# Altium schematic sheet Kasli-SOC_bank112.SchDoc: MGT
size 420 x 297 mm; CheckedBy: G.Kasprowicz; Author: F.Switakowski; CompanyName: WUT ISE; DrawnBy: F.Switakowski; Organization: WUT ISE; Address1: PW ISE; Address2: Nowowiejska 15/19 00-665 Warsaw; Address3: gkasprow@gmail.com; DocumentNumber: 5; Revision: 1; SheetNumber: 5; SheetTotal: 18; ModifiedBy: -; CheckedDate: -; Title2: & clock; DivGrp: WUT ISE; Designer: G.Kasprowicz; ModifiedDate: -; ProjectName: Sensor Box
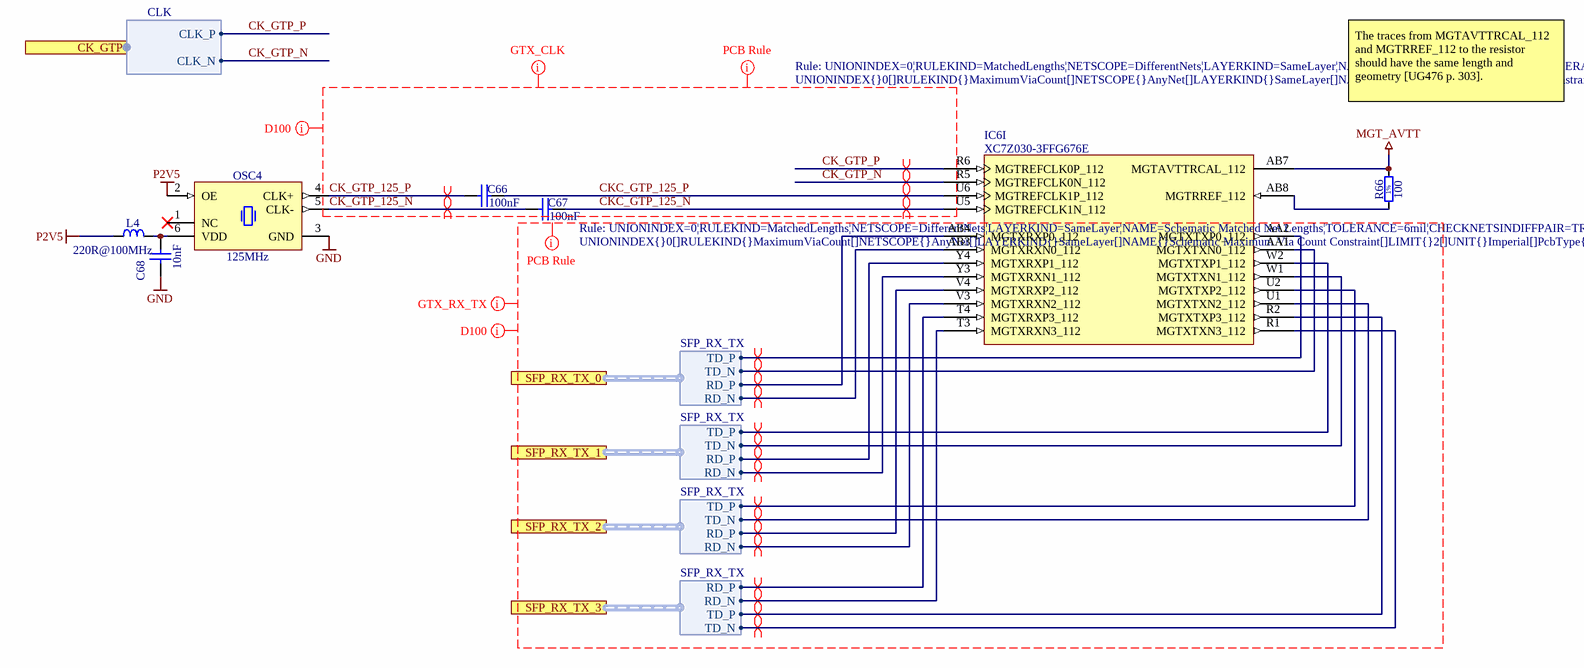
[diagram p0: Kasli-SOC_bank112.SchDoc]

## Parts
C66  100nF  [CAPC0603X33N]
C67  100nF  [CAPC0603X33N]
C68  10nF  [CAPC1005X55N]
IC6  XC7Z030-3FFG676E  [BGA676C100P26X26_2700X2700X324]  (part I of 14)
L4  220R@100MHz  [INDC2012X105N]
OSC4  125MHz  [OSC_SILICON-LAB_SI510-6N(5X7)]
R66  100  [RESC0603X28N]

## Ports
CK_GTP (harness CLK), SFP_RX_TX_0 (harness SFP_RX_TX), SFP_RX_TX_1 (harness SFP_RX_TX), SFP_RX_TX_2 (harness SFP_RX_TX), SFP_RX_TX_3 (harness SFP_RX_TX)

## Harnesses
SFP_RX_TX: RD_N, RD_P, TD_N, TD_P
CLK: CLK_P, CLK_N

## Nets
GND: C68.1 OSC4.3(GND)
MGT_AVTT: IC6.AB7(MGTAVTTRCAL_112) R66.2
P2V5: L4.1 OSC4.2(OE)
CK_GTP_125_N: C67.1 OSC4.5(CLK-)
CK_GTP_125_P: C66.1 OSC4.4(CLK+)
CK_GTP_N: IC6.R5(MGTREFCLK0N_112) ; port CK_GTP.CLK_N
CK_GTP_P: IC6.R6(MGTREFCLK0P_112) ; port CK_GTP.CLK_P
CKC_GTP_125_N: C67.2 IC6.U5(MGTREFCLK1N_112)
CKC_GTP_125_P: C66.2 IC6.U6(MGTREFCLK1P_112)
NetC68_2: C68.2 L4.2 OSC4.6(VDD)
NetIC6_AA1: IC6.AA1(MGTXTXN0_112) ; port SFP_RX_TX_0.TD_N
NetIC6_AA2: IC6.AA2(MGTXTXP0_112) ; port SFP_RX_TX_0.TD_P
NetIC6_AB3: IC6.AB3(MGTXRXN0_112) ; port SFP_RX_TX_0.RD_N
NetIC6_AB4: IC6.AB4(MGTXRXP0_112) ; port SFP_RX_TX_0.RD_P
NetIC6_AB8: IC6.AB8(MGTRREF_112) R66.1
NetIC6_R1: IC6.R1(MGTXTXN3_112) ; port SFP_RX_TX_3.TD_N
NetIC6_R2: IC6.R2(MGTXTXP3_112) ; port SFP_RX_TX_3.TD_P
NetIC6_T3: IC6.T3(MGTXRXN3_112) ; port SFP_RX_TX_3.RD_N
NetIC6_T4: IC6.T4(MGTXRXP3_112) ; port SFP_RX_TX_3.RD_P
NetIC6_U1: IC6.U1(MGTXTXN2_112) ; port SFP_RX_TX_2.TD_N
NetIC6_U2: IC6.U2(MGTXTXP2_112) ; port SFP_RX_TX_2.TD_P
NetIC6_V3: IC6.V3(MGTXRXN2_112) ; port SFP_RX_TX_2.RD_N
NetIC6_V4: IC6.V4(MGTXRXP2_112) ; port SFP_RX_TX_2.RD_P
NetIC6_W1: IC6.W1(MGTXTXN1_112) ; port SFP_RX_TX_1.TD_N
NetIC6_W2: IC6.W2(MGTXTXP1_112) ; port SFP_RX_TX_1.TD_P
NetIC6_Y3: IC6.Y3(MGTXRXN1_112) ; port SFP_RX_TX_1.RD_N
NetIC6_Y4: IC6.Y4(MGTXRXP1_112) ; port SFP_RX_TX_1.RD_P

Not connected (* = marked no-connect by the designer): OSC4 1(NC)*

## Layout directives
net class GTX_RXTX: (no net found under the mark)
rule Matched Net Lengths [Tolerance = 0.152mm]; rule Maximum Via Count Constraint [Max Count = 2]: (no net found under the mark)
net class GTX_CLK: CK_GTP_125_N, CK_GTP_125_P, CK_GTP_N, CK_GTP_P, CKC_GTP_125_N, CKC_GTP_125_P
rule Matched Net Lengths [Tolerance = 1.575mm]; rule Maximum Via Count Constraint [Max Count = 2]: CK_GTP_125_N, CK_GTP_125_P, CK_GTP_N, CK_GTP_P, CKC_GTP_125_N, CKC_GTP_125_P
differential pair; differential pair class Diff_100Ohm; differential pair class GTP: NetIC6_AA1, NetIC6_AA2, NetIC6_AB3, NetIC6_AB4, NetIC6_R1, NetIC6_R2, NetIC6_T3, NetIC6_T4, NetIC6_U1, NetIC6_U2, NetIC6_V3, NetIC6_V4, NetIC6_W1, NetIC6_W2, NetIC6_Y3, NetIC6_Y4
differential pair; differential pair class LVPECL: CK_GTP_N, CK_GTP_P
differential pair; differential pair class Diff_100Ohm: CK_GTP_125_N, CK_GTP_125_P, CKC_GTP_125_N, CKC_GTP_125_P
net class D100: (no net found under the mark), CK_GTP_125_N, CK_GTP_125_P, CK_GTP_N, CK_GTP_P, CKC_GTP_125_N, CKC_GTP_125_P

## Notes on the sheet
- The traces from MGTAVTTRCAL_112 and MGTRREF_112 to the resistor should have the same length and geometry [UG476 p. 303].
- Project/Equipment
- Document
- Designer
- Drawn by
- Check.by
- Copyright WUT ISE 2020.
  This documentation describes Open Hardware and is licensed under the CERN OHL v.1.2. You may redistribute and modify this documentation under the terms of the CERN OHL v.1.2. (http://ohwr.org/CERNOHL). This documentation is distributed WITHOUT ANY EXPRESS OR IMPLIED WARRANTY, INCLUDING OF MERCHANTABILITY, SATISFACTORY QUALITY AND FITNESS FOR A PARTICULAR PURPOSE. Please see the CERN OHL v.1.2 for applicable conditions.
- Contact
- File
- Last Mod.
- Print Date
- Sheet
- Size
- A3
- of
- Rev
- (in symbol R0201_100R_1%_0.05W_200PPM) 1%

## Library data of the parts
C66 C67 = CC0201_100NF_6.3V_10%_X5R: Non-polarised capacitor; Part Description: SMD Multilayer Chip Ceramic Capacitor; Manufacturer: GENERIC; Manufacturer1 Part Number: 02016D104KAT2A; Voltage: 6.3V; TC: X5R; Tolerance: ±10%; Part Number: CC0201_100NF_6.3V_10%_X5R; Component Kind: Standard; Component Type: Standard; Pin Count: 2; Value: 100nF; Status: Not Recommended; Manufacturer Part Number: CC0201_100NF_6.3V_10%_X5R; Case: 0201; Mounted: Yes; Socket: No; SMD: Yes; Sense: No; Manufacturer1 Example: AVX; Manufacturer1 ComponentHeight: 0.33mm; HelpURL: \\cern.ch\dfs\Applications\Altium\Datasheets\CC0201_X5R_AVX.pdf; Author: CERN DEM JLC; CreateDate: 2007-12-03; LatestRevisionDate: 2007-12-03
C68 = CC0402_10NF_16V_10%_X7R: Non-polarised capacitor; Part Description: SMD Multilayer Chip Ceramic Capacitor; Manufacturer: GENERIC; Manufacturer1 Part Number: 223878715636; Voltage: 16V; TC: X7R; Tolerance: ±10%; Part Number: CC0402_10NF_16V_10%_X7R; Component Kind: Standard; Component Type: Standard; Pin Count: 2; Value: 10nF; Status: Not Recommended; Manufacturer Part Number: CC0402_10NF_16V_10%_X7R; Case: 0402; Mounted: Yes; Socket: No; SMD: Yes; Sense: No; Manufacturer1 Example: PHYCOMP; Manufacturer1 ComponentHeight: 0.55mm; HelpURL: \\cern.ch\dfs\Applications\Altium\Datasheets\CC0402_X7R_PHYCOMP.pdf; Author: CERN DEM JLC; CreateDate: 03.12.2007; LatestRevisionDate: 03.12.2007
IC6 = XC7Z030-2FFG676I: 733 MHz Zynq™-7000 AP SoC, 130 PS I/O, 254 FPGA I/O, 676-Ball BGA, Speed Grade 2, Industrial Grade, Pb-Free; Part Description: Zynq™-7000 All Programmable SoC, Dual-core ARM® Cortex™-A9 CPU, 676-Ball BGA, Speed Grade 2, Industrial Grade, Pb-Free; Manufacturer: XILINX; PressFit: No; Bonding: No; Part Number: XC7Z030-3FFG676E; Component Kind: Standard; Component Type: Standard; Device: XC7Z030-2FFG676I; PackageDescription: BGA, 1.00mm Pitch, Square; 676 Pin, 26 Columns X 26 Rows, 27.00mm X 27.00mm X 2.60mm H; Manufacturer Part Number: XC7Z030-3FFG676E; Pin Count: 676; Case: BGA676; Mounted: Yes; Socket: No; SMD: Yes; Sense: No; ComponentHeight: 3.24mm; HelpURL: \\cern.ch\dfs\Applications\Altium\Datasheets\XC7Z030-2FFG676I.pdf; ComponentLink1URL: \\cern.ch\dfs\Applications\Altium\Datasheets\XC7Z030-2FFG676I_Package.pdf; ComponentLink1Description: Package; ComponentLink2URL: \\cern.ch\dfs\Applications\Altium\Datasheets\XC7Z030-2FFG676I_Pinout.txt; ComponentLink2Description: Pinout; Author: CERN DEM JLC; CreateDate: 29/04/2014; LatestRevisionDate: 29/04/2014
L4 = IND0805_MURATA_BLM21PG221SN1D: Inductor; Part Description: SMD EMIFIL Suppression Chip Ferrite Bead; Manufacturer: MURATA; Power: 2A; Resistance: 0.05R; Tolerance: ±25%; Part Number: IND0805_MURATA_BLM21PG221SN1D; Component Kind: Standard; Component Type: Standard; Pin Count: 2; Value: 220R@100MHz; Status: None; Manufacturer Part Number: BLM21PG221SN1D; Case: 0805; Mounted: Yes; Socket: No; SMD: Yes; Sense: No; ComponentHeight: 1.05mm; HelpURL: \\cern.ch\dfs\Applications\Altium\Datasheets\IND0805_MURATA_BLM21P.pdf; Author: CERN DEM JLC; CreateDate: 25/01/2010; LatestRevisionDate: 25/01/2010
OSC4 = OSC_125MHZ_SILICON-LAB_510FBA125M000AAG: Crystal Oscillator 6 pins, Si510 (LVDS/LVPECL/HCSL/Dual CMOS); Part Description: 2.5V ±25ppm LVDS Crystal Oscillator (XO), Si510 Series; Manufacturer: SILICON LABS; PressFit: No; Bonding: No; Part Number: OSC_125MHZ_SILICON-LAB_510FBA125M000AAG; Component Kind: Standard; Component Type: Standard; PackageDescription: Oscillator Si510 Series, 6 pins, 5x7mm; Value: 125MHz; Manufacturer Part Number: 510FBA125M000AAG; Pin Count: 6; Mounted: Yes; Socket: No; SMD: Yes; Sense: No; ComponentHeight: 1.8mm; HelpURL: \\cern.ch\dfs\Applications\Altium\Datasheets\OSC_SILICON-LAB_SI510.pdf; Author: CERN DEM JMW; CreateDate: 10.08.2015; LatestRevisionDate: 26.11.2018
R66 = R0201_100R_1%_0.05W_200PPM: Resistor - 1%; Part Description: Thick Film Chip Resistor; Manufacturer: GENERIC; Manufacturer1 Part Number: CRCW0201100RFNED; Power: 0.05W; TC: ±200ppm/°C; PressFit: No; Part Number: R0201_100R_1%_0.05W_200PPM; Component Kind: Standard; Component Type: Standard; Pin Count: 2; Value: 100; Status: Not Recommended; Tolerance: ±1%; Manufacturer Part Number: R0201_100R_1%_0.05W_200PPM; Case: 0201; Mounted: Yes; Sense: No; Socket: No; SMD: Yes; Manufacturer1 Example: VISHAY; Manufacturer1 ComponentHeight: 0.27mm; HelpURL: \\cern.ch\dfs\Applications\Altium\Datasheets\R0201_VISHAY_CRCW0201 e3.pdf; Author: CERN DEM JLC; CreateDate: 13.11.2014; LatestRevisionDate: 13.11.2014